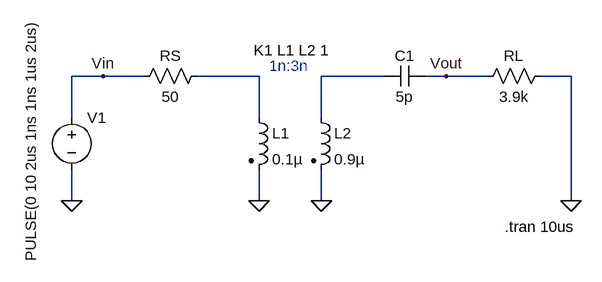
[diagram p0: schematic Draft1.asc]
Draft1.asc, the LTspice schematic file:
Version 4
SHEET 1 880 680
WIRE 96 -16 48 -16
WIRE 160 -16 96 -16
WIRE 336 -16 240 -16
WIRE 528 -16 432 -16
WIRE 624 -16 592 -16
WIRE 688 -16 624 -16
WIRE 816 -16 768 -16
WIRE 48 48 48 -16
WIRE 336 48 336 -16
WIRE 432 48 432 -16
WIRE 48 176 48 128
WIRE 336 176 336 128
WIRE 432 176 432 128
WIRE 816 176 816 -16
FLAG 336 176 0
FLAG 432 176 0
FLAG 816 176 0
FLAG 48 176 0
FLAG 96 -16 Vin
FLAG 624 -16 Vout
SYMBOL voltage 48 32 R0
WINDOW 3 -63 -133 VRight 2
WINDOW 123 0 0 Left 2
WINDOW 39 0 0 Left 2
SYMATTR InstName V1
SYMATTR Value PULSE(0 10 2us 1ns 1ns 1us 2us)
SYMBOL res 256 -32 R90
WINDOW 0 0 56 VBottom 2
WINDOW 3 32 56 VTop 2
SYMATTR InstName RS
SYMATTR Value 50
SYMBOL ind2 320 32 R0
SYMATTR InstName L1
SYMATTR Value 0.1µ
SYMATTR Type ind
SYMBOL ind2 416 32 R0
SYMATTR InstName L2
SYMATTR Value 0.9µ
SYMATTR Type ind
SYMBOL res 784 -32 R90
WINDOW 0 0 56 VBottom 2
WINDOW 3 32 56 VTop 2
SYMATTR InstName RL
SYMATTR Value 3.9k
SYMBOL cap 592 -32 R90
WINDOW 0 0 32 VBottom 2
WINDOW 3 32 32 VTop 2
SYMATTR InstName C1
SYMATTR Value 5p
TEXT 328 -56 Left 2 !K1 L1 L2 1
TEXT 352 -32 Left 2 ;1n:3n
TEXT 714 216 Left 2 !.tran 10us

The netlist it stands for:
* Draft1.asc
V1 Vin 0 PULSE(0 10 2us 1ns 1ns 1us 2us)
RS N001 Vin 50
L1 N001 0 0.1µ
L2 N002 0 0.9µ
RL 0 Vout 3.9k
C1 Vout N002 5p
K1 L1 L2 1
* 1n:3n
.tran 10us
.backanno
.end

* Results of the author's LTspice run, read from the files saved beside the schematic
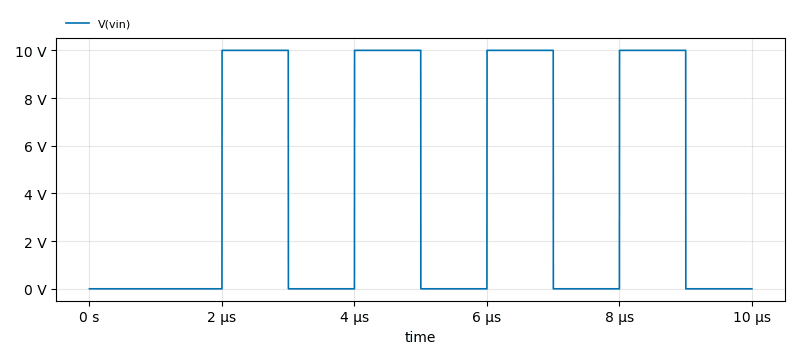
[diagram p1: Transient Analysis of Draft1.asc, plotted from the saved traces]
* Transient Analysis, 1 run:
*   V(vin): min 0 V, max 10 V, average 4.004 V, rms 6.327 V, last 0 V